# EAGLE design lcd_duffle_smd_mk_2 (EAGLE 6.4)
LCD Dufflebag Ride-along I2C interface for a standard LCD screen, including RGB support. Uses an ATTiny84 plus WS2811 (for backlight control). This is the PTH version
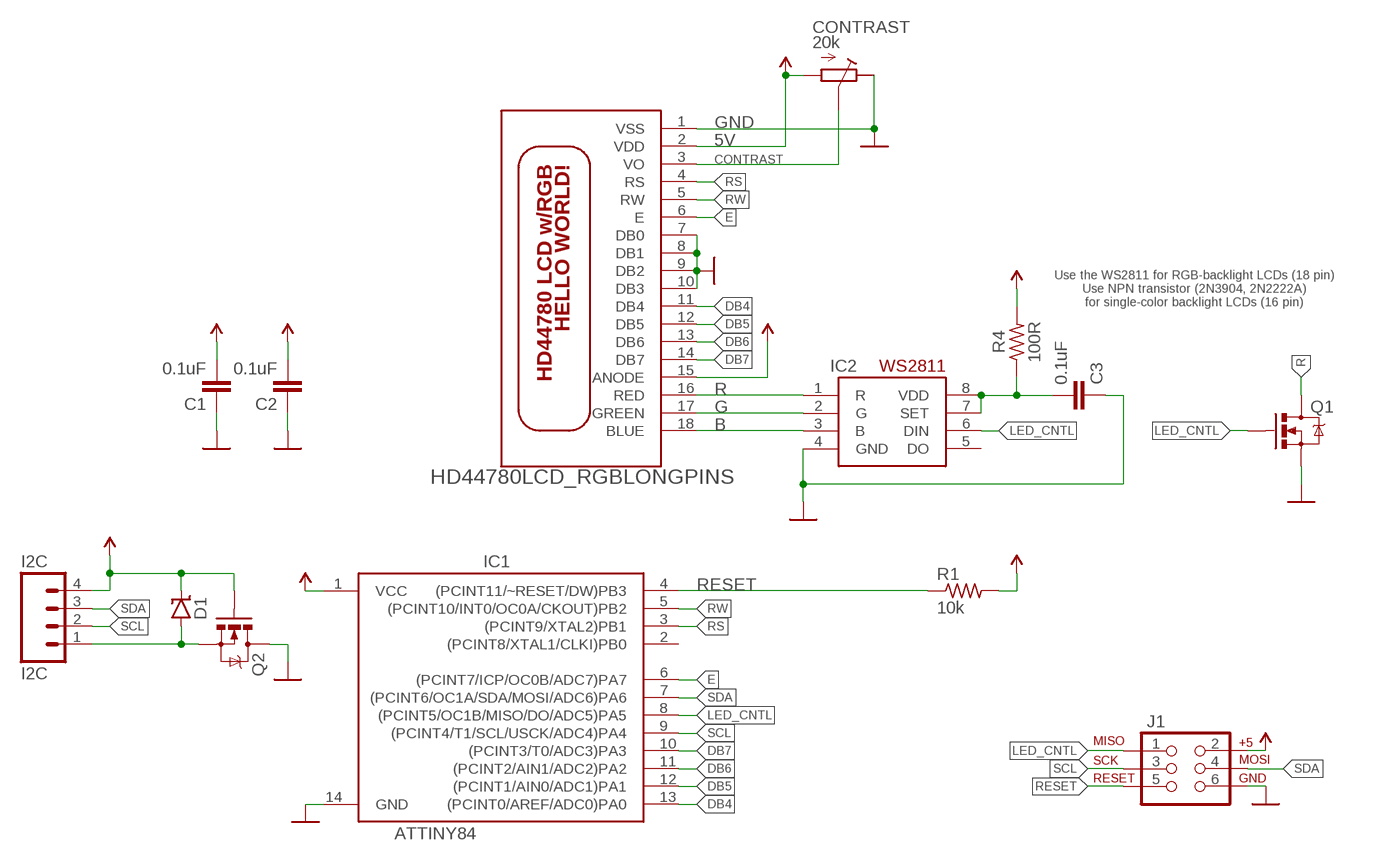
[diagram p0: schematic, sheet 1]

## Parts
C1  0.1uF  CAPACITOR-CERAMICC0603  [C0603]
C2  0.1uF  CAPACITOR-CERAMICC0603  [C0603]
C3  0.1uF  CAPACITOR-CERAMICC0603  [C0603]
CONTRAST  20k  POTENTIOMETERTHUMBWHEEL-16MM  [POT-THUMBWHEEL]
D1  DIODE-ZENERSOD123  [SOD123]
I2C  I2C  M04SMD  [1X04-SMD]
IC1  ATTINY84  [SO14]
IC2  WS2811  WS2811-SOP8  [SO08-SKINNYPADS]
J1  AVR_SPI_PRG_6TESTPOINTS  [2X3_TEST_POINTS]
Q1  MOSFET-NCHANNELIRLML2502  [SOT23]
Q2  MOSFET-NCHANNELIRLML2502  [SOT23]
R1  10k  RESISTORR0603  [R0603]
R4  100R  RESISTORR0603  [R0603]
U$1  HD44780LCD_RGBLONGPINS  [LCD1602-RGB-CENTERED]

## Nets
5V: C1.2 C2.2 CONTRAST.1(A) D1.C I2C.4 IC1.1(VCC) J1.2 Q2.1(G) R1.2 R4.2 U$1.2(VDD) U$1.15(ANODE)
B: IC2.3(B) U$1.18(BLUE)
CONTRAST: CONTRAST.2(S) CONTRAST.2@1(S) U$1.3(VO)
DB4: IC1.13((PCINT0/AREF/ADC0)PA0) U$1.11(DB4)
DB5: IC1.12((PCINT1/AIN0/ADC1)PA1) U$1.12(DB5)
DB6: IC1.11((PCINT2/AIN1/ADC2)PA2) U$1.13(DB6)
DB7: IC1.10((PCINT3/T0/ADC3)PA3) U$1.14(DB7)
E: IC1.6((PCINT7/ICP/OC0B/ADC7)PA7) U$1.6(E)
G: IC2.2(G) U$1.17(GREEN)
GND: C1.1 C2.1 C3.1 CONTRAST.3(E) IC1.14(GND) IC2.4(GND) J1.6 Q1.2(S) Q2.3(D) U$1.1(VSS) U$1.7(DB0) U$1.8(DB1) U$1.9(DB2) U$1.10(DB3)
LED_CNTL: IC1.8((PCINT5/OC1B/MISO/DO/ADC5)PA5) IC2.6(DIN) J1.1 Q1.1(G)
N$1: D1.A I2C.1 Q2.2(S)
N$2: C3.2 IC2.7(SET) IC2.8(VDD) R4.1
R: IC2.1(R) Q1.3(D) U$1.16(RED)
RESET: IC1.4((PCINT11/~RESET/DW)PB3) J1.5 R1.1
RS: IC1.3((PCINT9/XTAL2)PB1) U$1.4(RS)
RW: IC1.5((PCINT10/INT0/OC0A/CKOUT)PB2) U$1.5(RW)
SCL: I2C.2 IC1.9((PCINT4/T1/SCL/USCK/ADC4)PA4) J1.3
SDA: I2C.3 IC1.7((PCINT6/OC1A/SDA/MOSI/ADC6)PA6) J1.4
Unconnected: IC1.2((PCINT8/XTAL1/CLKI)PB0) IC2.5(DO)

## Notes on the sheet
- Use the WS2811 for RGB-backlight LCDs (18 pin)
  Use NPN transistor (2N3904, 2N2222A)
  for single-color backlight LCDs (16 pin)

## Library data of the parts
C1-C3 = A_butts:CAPACITOR-CERAMIC: CAPACITOR, European symbol
CONTRAST = A_butts:POTENTIOMETER: Trimm resistor
D1 = A_butts:DIODE-ZENER: Zener Diode Production Part - 8199 3.4V Zener Voltage
I2C = A_butts:M04: Header 4 Standard 4-pin 0.1" header. Use with straight break away headers (SKU : PRT-00116), right angle break away headers (PRT-00553), swiss pins (PRT-00743), machine pins (PRT-00117), and female headers (PRT-00115). Molex polarized connector foot print use with SKU : PRT-08231 with associated crimp pins and housings. 1MM SMD Version SKU: PRT-10208
IC1 = A_butts:ATTINY84: Atmel 14-pin 2/4/8kB flash uC
IC2 = A_butts:WS2811
J1 = A_butts:AVR_SPI_PRG_6: AVR ISP 6 Pin This is the reduced ISP connector for AVR programming. Common on Arduino. This footprint will take up less PCB space and can be used with a 10-pin to 6-pin adapter such as SKU: BOB-08508 **Special note about "TEST_POINT" package. The stop mask is on the top side, so if you want your programming test points to be on the bottom of your board, make sure to place this package on the bottom side of the board. This also ensure that the orientation to program from the bottom side will be correct.
Q1 Q2 = A_butts:MOSFET-NCHANNEL: Common NMOSFET Parts MFG P/N Store ID Prod ID FDD8780 TRANS-09984 SI7820DN TRANS-11055 FDS6630A IC-08089 2N7002PW TRANS-11151 FQP30N06L COM-10213 TRANS-10060 BSS123LT1G TRANS-08345 BSS138 TRANS-00830 BS170 2N7000
R1 R4 = A_butts:RESISTOR: RESISTOR, American symbol
U$1 = A_butts:HD44780LCD_RGB

## Board
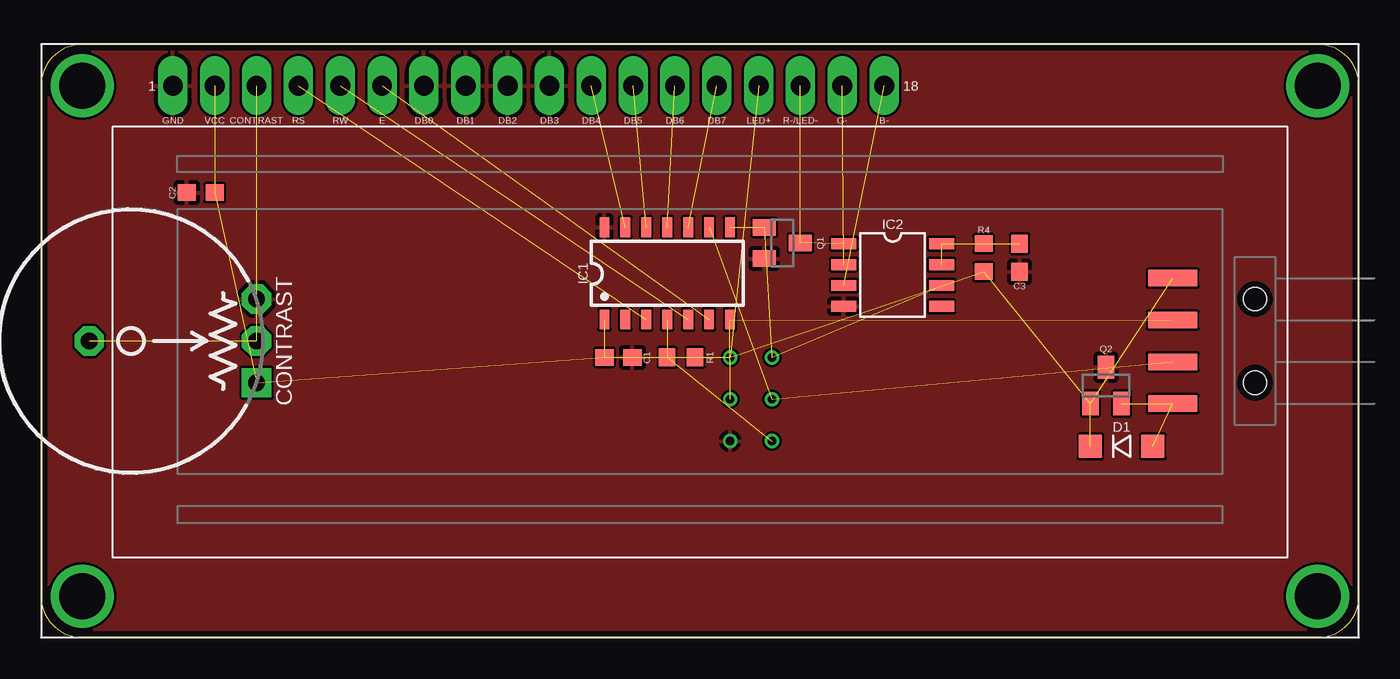
[diagram p1: board, top side]
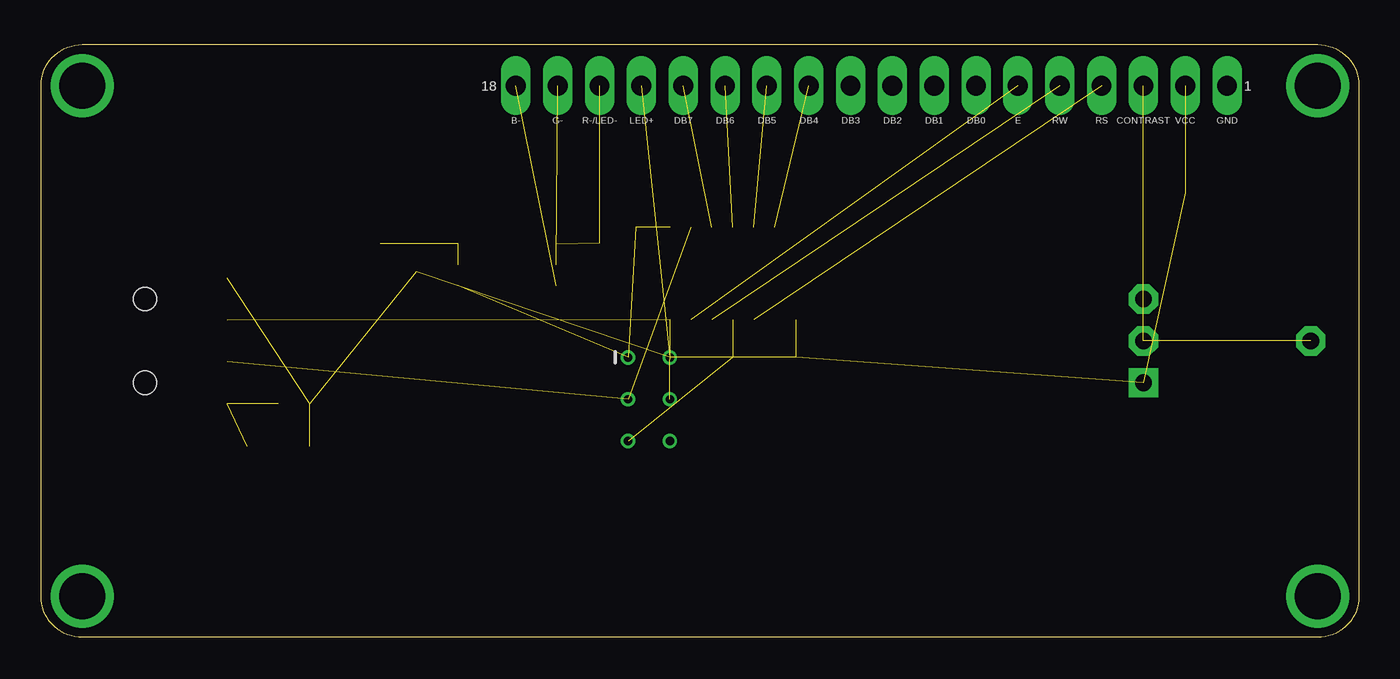
[diagram p2: board, bottom side, seen from below]

Size 80 x 36 mm. Coordinates in mm from the lower left corner, seen from the top.
Outline: 0,33.5 0,2.5 arc90 2.5,0 77.5,0 arc90 80,2.5 80,33.5 arc90 77.5,36 2.5,36 arc90 0,33.5
Copper layers (1*16): Top 0.0356mm / dielectric 1.5011mm / Bottom 0.0356mm
Design rules "LaenPCBOrder2": minimum track width 6mil, minimum drill 13mil, track to track 6mil, track to pad 6mil, pad to pad 6mil, via to via 6mil, smd to smd 6mil, copper to edge 15mil, drill to drill 6mil, minimum pad ring 7mil, minimum via ring 7mil, stop-mask expansion 3mil, vias tented up to drill 20mil, thermal gap 10mil

### Footprints (pad centres in the part's own frame; a part is rotated, then mirrored left to right if it is on the bottom)
C0603 = smd 1.1 x 1: 1 -0.85,0; 2 0.85,0
POT-THUMBWHEEL = drill 1.016 pad 1.778 square: 1 -2.54,0 | drill 1.016 pad 1.778 octagon: 2 0,0; 2@1 0,10.16; 3 2.54,0
SOD123 = smd 1.4 x 1.4: A 1.9,0; C -1.9,0
1X04-SMD = smd 1 x 3: 1 -3.81,5; 2 -1.27,5; 3 1.27,5; 4 3.81,5 | hole 1.4: -2.54,0; 2.54,0
SO14 = smd 0.6 x 1.2: 1 -3.81,-2.8; 2 -2.54,-2.8; 3 -1.27,-2.8; 4 0,-2.8; 5 1.27,-2.8; 6 2.54,-2.8; 7 3.81,-2.8; 8 3.81,2.8; 9 2.54,2.8; 10 1.27,2.8; 11 0,2.8; 12 -1.27,2.8; 13 -2.54,2.8; 14 -3.81,2.8
SO08-SKINNYPADS = smd 0.66 x 1.524: 1 -1.905,-2.973; 2 -0.635,-2.973; 3 0.635,-2.973; 4 1.905,-2.973; 5 1.905,2.973; 6 0.635,2.973; 7 -0.635,2.973; 8 -1.905,2.973
2X3_TEST_POINTS = drill 0.508: 1 -2.54,-1.27; 2 -2.54,1.27; 3 0,-1.27; 4 0,1.27; 5 2.54,-1.27; 6 2.54,1.27
SOT23 = smd 1 x 1.4: 1 -0.95,-1.1; 2 0.95,-1.1; 3 0,1.1
R0603 = smd 1 x 1.1: 1 -0.85,0; 2 0.85,0
LCD1602-RGB-CENTERED = drill 1.2 pad 1.778 long: 1 -32,15.5; 2 -29.46,15.5; 3 -26.92,15.5; 4 -24.38,15.5; 5 -21.84,15.5; 6 -19.3,15.5; 7 -16.76,15.5; 8 -14.22,15.5; 9 -11.68,15.5; 10 -9.14,15.5; 11 -6.6,15.5; 12 -4.06,15.5; 13 -1.52,15.5; 14 1.02,15.5; 15 3.56,15.5; 16 6.1,15.5; 17 8.64,15.5; 18 11.18,15.5 | drill 2.8 pad 3.81: HOLE1 -37.5,15.5; HOLE2 37.5,15.5; HOLE3 -37.5,-15.5; HOLE4 37.5,-15.5

### Placement (x,y rotation side)
C1  35.05,17 180 top
C2  9.69,27 0 top
C3  59.4,23.05 90 top
CONTRAST  13.08,18 90 top
D1  65.6,11.6 0 top
I2C  73.7,18 90 top
IC1  38.01,22.1 0 top
IC2  51.7,22 270 top
J1  43.1,14.46 270 bottom
Q1  45,23.95 270 top
Q2  64.65,15.3 0 top
R1  38.86,17 0 top
R4  57.22,23.05 270 top
U$1  40,18 0 top

### Tracks (layer width: path | path; a pad name or v marks a point on that pad's centre or on a via)
5V  (11 unrouted)
B  (1 unrouted)
CONTRAST  (2 unrouted)
DB4  (1 unrouted)
DB5  (1 unrouted)
DB6  (1 unrouted)
DB7  (1 unrouted)
E  (1 unrouted)
G  (1 unrouted)
GND
  pour Top: 80,33.5 80,2.5 arc-90 77.5,0 2.5,0 arc-90 0,2.5 0,33.5 arc-90 2.5,36 77.5,36 arc-90
LED_CNTL  (3 unrouted)
N$1  (2 unrouted)
N$2  (3 unrouted)
R  (2 unrouted)
RESET  (2 unrouted)
RS  (1 unrouted)
RW  (1 unrouted)
SCL  (2 unrouted)
SDA  (2 unrouted)